# Altium schematic sheet Battery_Charger.SchDoc: Battery Charger and Power Management
size A4; Organization: TechLabs Global Pvt Ltd; DocumentNumber: 2; Revision: 1.0; SheetNumber: 2; SheetTotal: 3
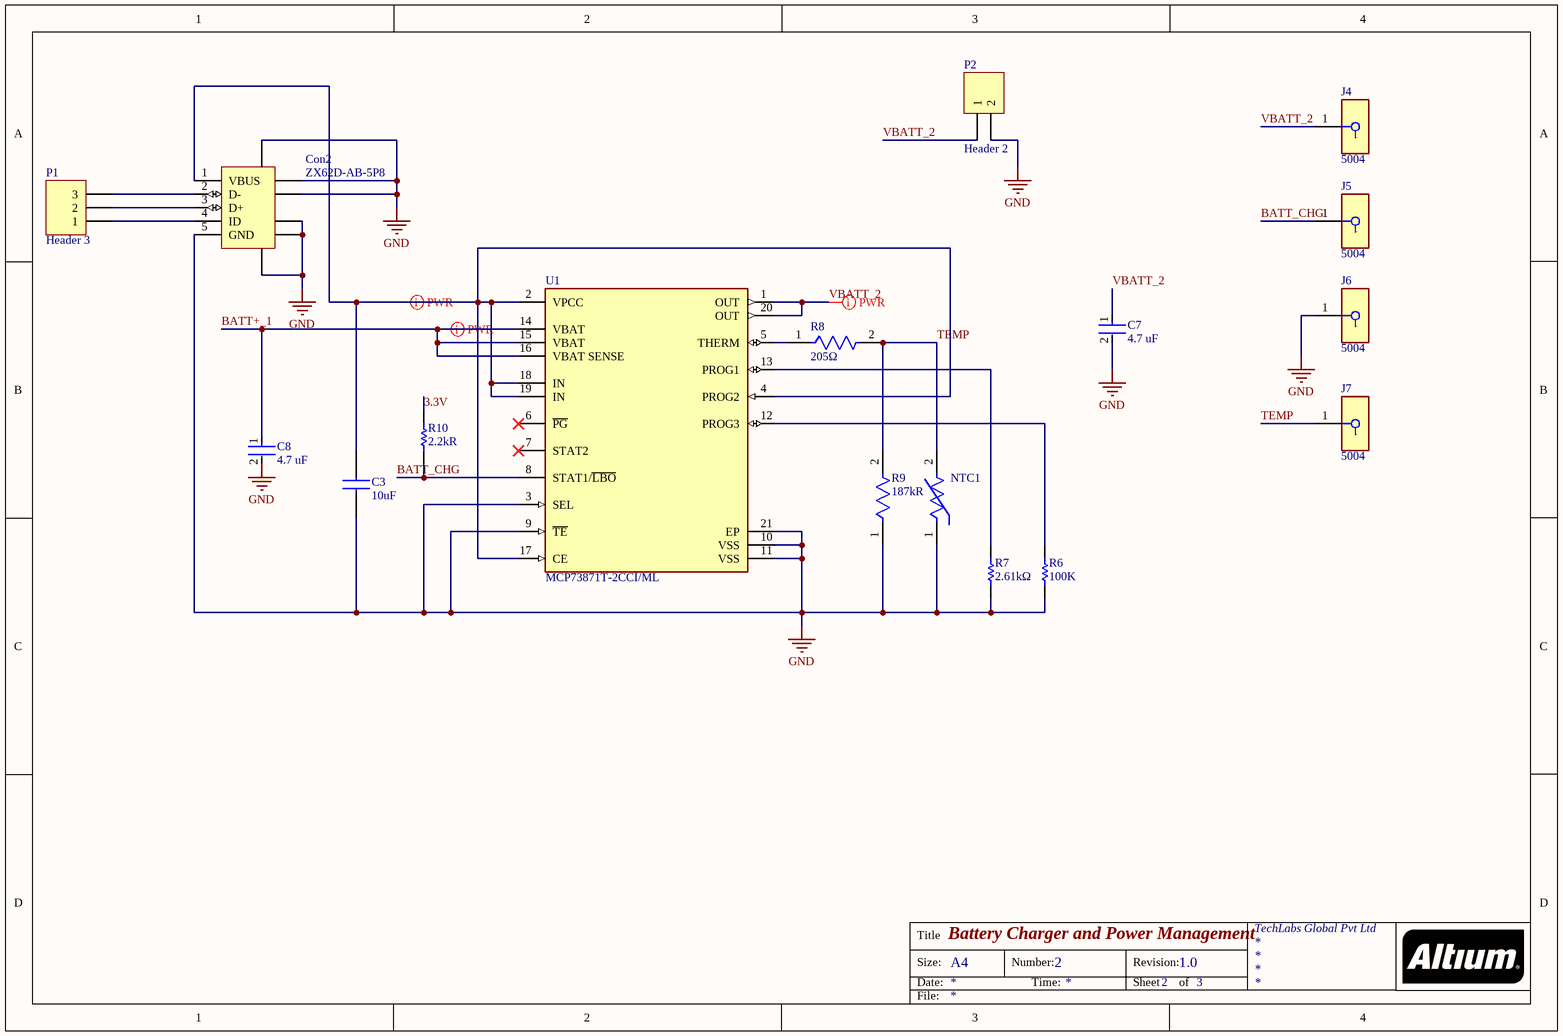
[diagram p0: Battery_Charger.SchDoc]

## Parts
C3  10uF  [CAPC1005X70N]
C7  4.7 uF  [FP-CC0402-MFG]
C8  4.7 uF  [FP-CC0402-MFG]
Con2  ZX62D-AB-5P8  [HIRO-ZX62D-AB-5P8_V]
J4  5004  [FP-5004-MFG]
J5  5004  [FP-5004-MFG]
J6  5004  [FP-5004-MFG]
J7  5004  [FP-5004-MFG]
NTC1  NTC 10K Radial Leaded  [FP-NXR_151B030-MFG]  (value not drawn)
P1  Header 3  [HDR1X3]
P2  Header 2  [HDR1X2]
R6  100K  [RESC1005X40X25NL05T10]
R7  2.61kΩ  [RESC1005X40X25NL05T10]
R8  205Ω  [FP-RT0402-MFG]
R9  187kR  [FP-AC0402-MFG]
R10  2.2kR  [RESC1005X40X25ML05T10]
U1  MCP73871T-2CCI/ML  [FP-C04-126-IPC_C]

## Nets
GND: C3.1 C7.2 C8.2 Con2.5(GND) Con2.6(SHLD) Con2.7(SHLD) Con2.8(SHLD) Con2.9(SHLD) Con2.10(SHLD) Con2.11(SHLD) J6.1 NTC1.1 P2.2 R6.1 R7.1 R9.1 U1.3(SEL) U1.9(~{TE}) U1.10(VSS) U1.11(VSS) U1.21(EP)
3.3V: R10.2
BATT+_1: C8.1 U1.14(VBAT) U1.15(VBAT) U1.16(VBAT_SENSE)
BATT_CHG: J5.1 R10.1 U1.8(STAT1/~{LBO})
TEMP: J7.1 NTC1.2 R8.2 R9.2
VBATT_2: C7.1 J4.1 P2.1 U1.1(OUT) U1.20(OUT)
NetC3_2: C3.2 Con2.1(VBUS) U1.2(VPCC) U1.4(PROG2) U1.17(CE) U1.18(IN) U1.19(IN)
NetCon2_2: Con2.2(D-) P1.3
NetCon2_3: Con2.3(D+) P1.2
NetCon2_4: Con2.4(ID) P1.1
NetR6_2: R6.2 U1.12(PROG3)
NetR7_2: R7.2 U1.13(PROG1)
NetR8_1: R8.1 U1.5(THERM)

Not connected (* = marked no-connect by the designer): U1 6(~{PG})* 7(STAT2)*

## Layout directives
rule Width Constraint [Pref Width = 20mil    Min Width = 12mil    Max Width = 36mil]: BATT+_1, NetC3_2, VBATT_2

## Notes on the sheet
- Title
- Size:
- Date:
- A4
- Number:
- Time:
- Revision:
- Sheet
- of
- File:

## Library data of the parts
C3 = CL05A106MQ5NUNC: CAP CER 10UF 6.3V X5R 0402; Manufacturer: Samsung Electro-Mechanics; Geometry.Height: 0.7mm; Mfr. Part #: CL05A106MQ5NUNC; Mouser Part Number: 187-CL05A106MQ5NUNC; Mouser Price/Stock: https://www.mouser.co.uk/ProductDetail/Samsung-Electro-Mechanics/CL05A106MQ5NUNC?qs=X6jEic%2FHinDK8vVLi1zwpw%3D%3D; Arrow Part Number: CL05A106MQ5NUNC; Arrow Price/Stock: https://www.arrow.com/en/products/cl05a106mq5nunc/samsung-electro-mechanics?region=nac; Datasheet Link: https://datasheet.datasheetarchive.com/originals/distributors/Datasheets-DGA10/2406160.pdf; LCSC Part #: C15525; Package: 0402; Value: 10uF; Digi-Key Part #: 1276-1451-2-ND
C7 C8 = CMP-1034-02137-2: CAP CER 4.7UF 6.3V X5R 0402; Manufacturer: YAGEO; Mfr. Part #: CC0402MRX5R5BB475; Temperature Coefficient: 30ppm/°C; Tolerance: 0.2; Automotive Grade: NA; Material: Ceramic; Automotive: No; Temperature: -55°C to +125°C; Category: Cap; Ipc Land Pattern Name: CAPC10050X50; Digikey Description: CAP CER 4.7UF 6.3V X5R 0402; ComponentLink2Description: Datasheet; Octopart: https://octopart.com/cc0402mrx5r5bb475-yageo-20021081; Mouser Description: Multilayer Ceramic Capacitors MLCC - SMD/SMT 4.7uF 6.3V X5R 20%; Device Class L1: Passive Components; Footprint Url: http://www.yageo.com/exep/pages/download/literatures/UPY-C_GEN_24.pdf; Value: 4.7 uF; Temperature Range High: +125°C; ComponentLink2URL: http://www.yageo.com/documents/recent/UPY-GP_NP0_16V-to-50V_16.pdf; Voltage Rating: 6.3 V; Height: 0.55mm; RoHS: TRUE; Package: CC0402; Device Class L3: Ceramic Capacitors; Temperature Characteristic: X5R; Temperature Range Low: -55°C; Capacitance: 4.7 uF; Device Class L2: Capacitors; Lead Free: Yes; LCSC Part #: C106859; Digi-Key Part #: 311-1730-2-ND
Con2 = CMP-1349-00001-2: USB 2.0 Standard Micro-USB Connector, Micro AB-Standard (Bottom Mount), 30 V AC, -30 to 85 degC, Right Angle, 5-Pin 7.5 x 5.6 x 2.8 mm SMD, RoHS, Reel; Mfr. Part #: ZX62D-AB-5P8(30); Manufacturer: Hirose Electric; Number of Contacts: 5; Capacitance: 2 pF Max.; Voltage Rating: 30 V AC; Contact Resistance: 30 mOhm Max.; Mounting Technology: Surface Mount; ComponentLink1URL: http://www.hirose.com/; ComponentLink2URL: http://www.hirose.co.jp/cataloge_hp/ed_ZX_20140804.pdf; ComponentLink1Description: Manufacturer URL; ComponentLink3Description: Package Specification; Operating Temperature Range: -30 to 85 degC; RoHS: TRUE; DatasheetVersion: Aug-14; PackageDescription: USB Micro-AB Connector, Right Angle, Body 7.5 x 5.6 mm, Pitch 0.65 mm, Height 2.8 mm; ComponentLink3URL: http://www.hirose.co.jp/cataloge_hp/ed_ZX_20140804.pdf; Packing: Reel; ComponentLink2Description: Datasheet; LCSC Part #: C598206; Package: SMD; Digi-Key Part #: H125271TR-ND
J4-J7 = CMP-2000-05575-2: PC TEST POINT MINIATURE YELLOW; Manufacturer: Keystone; Number Of Contacts: 1; Is Female: yes; Device Class L1: Connectors; Mfr. Part #: 5004; Digikey Description: PC TEST POINT MINIATURE YELLOW; ComponentLink2URL: https://www.keyelco.com/product-pdf.cfm?p=1313; Lead Free: Yes; ComponentLink2Description: Datasheet; Category: Conn; Height: 4.72mm; Octopart: https://octopart.com/5004-keystone-28591; Mouser Description: TEST POINT PC MINI .040"D YELLOW; Device Class L3: unset; Contact Material: Silver; Package: 5004; Automotive: No; Device Class L2: unset; RoHS: TRUE; LCSC Part #: C2906762; Digi-Key Part #: 36-5004-ND
NTC1 = CMP-06022-001050-1: NTC Thermistors ±1% 7.5mW 3380K ±1% 10kΩ Radial Leaded NTC Thermistors ROHS; Manufacturer: Murata Electronics; Mfr. Part #: NXRT15XH103FA1B030; Resistance: 10kR; Lead Diameter: 0.4mm; RoHS Compliant: Yes; Number of Pins: 2; Lead Free: Lead Free; Max Power Dissipation: 7.5mW; Height: 2mm; Lead Pitch: 2.5mm; Power Rating: 7.5mW; Series: NXR; Packaging: Bulk; Package Quantity: 500; Width: 4mm; Max Operating Temperature: 125°C; Termination: Radial; Min Operating Temperature: -40°C; Tolerance: 1%; Resistance Tolerance: 1%; Length: 5mm; Mount: Through Hole; B-Constant: 3380K; LCSC Part #: C152559; Datasheet: https://datasheet.lcsc.com/lcsc/1810170223_Murata-Electronics-NXRT15XH103FA1B030_C152559.pdf; Resistance in Ohms @ 25°C: 10K; Digi-Key Part #: 490-8601-ND
P1 = Header 3: Header, 3-Pin; LatestRevisionDate: 17-Jul-2002; LatestRevisionNote: Re-released for DXP Platform.; Publisher: Altium Limited
P2 = Header 2: Header, 2-Pin; LatestRevisionDate: 17-Jul-2002; LatestRevisionNote: Re-released for DXP Platform.; Publisher: Altium Limited
R6 = CMP-2002-07343-1: 100K ±1% 1/16W 0402 Chip Resistor - Surface Mount RoHS; Manufacturer: Yageo / Phycomp; Mfr. Part #: RC0402FR-07100KL; Resistance: 100K; LCSC Part #: Tolerance; Package: 0402; Power (Watts): 1/16W; Tolerance: ±1%; Digi-Key Part #: 311-100KLRTR-ND
R7 = CMP-2002-07573-1: 62.5mW Thick Film Resistors 50V ±100ppm/℃ ±1% -55℃~+155℃ 2.61kΩ 0402 Chip Resistor - Surface Mount ROHS; Manufacturer: Yageo / Phycomp; Mfr. Part #: RC0402FR-072K61L; LCSC Part #: C163472; Package: 0402; Value: 2.61kΩ; Tolerance: ±1%; Digi-Key Part #: YAG3103TR-ND
R8 = CMP-03412-026788-1: 205Ω 50V ±50ppm/℃ -55℃~+155℃ ±1% Thin Film Resistor 62.5mW 0402 Chip Resistor - Surface Mount ROHS; Mfr. Part #: RT0402FRE07205RL; Manufacturer: Yageo; Tolerance: 0.01; Power Rating: 0.063W; Temperature Coefficient: 50 ppm/°C; Temperature: -55°C to +155°C; Category: Res; ComponentLink2URL: http://www.yageo.com/documents/recent/PYu-RT_1-to-0.01_RoHS_L_9.pdf; Footprint Url: http://www.yageo.com/exep/pages/download/literatures/PYu-R_Mount_10.pdf; Octopart: https://octopart.com/rt0402fre07205rl-yageo-1208039; Device Class L3: Chip SMD Resistors; Device Class L1: Passive Components; Device Class L2: Resistors; Lead Free: Yes; Package: RT0402; Automotive: No; Series: RT; Composition: Thin Film; Value: 205Ω; Digikey Description: RES SMD 205 OHM 1% 1/16W 0402; Voltage Rating: 50V; Temperature Range High: +155°C; ComponentLink2Description: Datasheet; Ipc Land Pattern Name: RESC10050X30; Temperature Range Low: -55°C; RoHS: TRUE; Height: 0.35mm; Resistance: 205Ω; LCSC Part #: C327014; Digi-Key Part #: RT0402FRE07205RL-ND
R9 = CMP-03412-002180-2: 187kΩ ±1% -55℃~+155℃ 50V Thick Film Resistors 62.5mW ±100ppm/℃ 0402 Chip Resistor - Surface Mount ROHS; Manufacturer: YAGEO; Mfr. Part #: AC0402FR-07187KL; Max Power Dissipation: 63mW; Temperature Coefficient: 100ppm/°C; Series: AC; Tolerance: 1%; Resistor Type: Thick Film; Features: Moisture Resistant; Resistance: 187kR; RoHS Compliant: Yes; Length: 0.039inch; Width: 0.02inch; Height: 0.015inch; Number of Terminations: 2; Min Operating Temperature: -55°C; Package: 0402; Max Operating Temperature: 155°C; Packaging: Tape and Reel; Value: 187kR; LCSC Part #: C226824; Digi-Key Part #: 13-AC0402FR-07187KLTR-ND
R10 = CMP-2002-07567-1: 62.5mW Thick Film Resistors 50V ±100ppm/℃ ±1% -55℃~+155℃ 2.2kΩ 0402 Chip Resistor - Surface Mount ROHS; Manufacturer: Yageo / Phycomp; Mfr. Part #: RC0402FR-072K2L; Power (Watts): 63mW; LCSC Part #: C114762; Package: 0402; Tolerance: 1%; Value: 2.2kR; Digi-Key Part #: 311-2.20KLRTR-ND
U1 = CMP-06318-000014-1: IC USB/AC BATT CHRGR W/PPM 20QFN; Manufacturer: Microchip Technology; Mfr. Part # (Alternative): MCP73871-2CCI/ML; Min Supply Voltage: 4.5V; Output Current: 1A; Output Voltage: 4.2V; Max Supply Voltage: 6V; Case/Package: QFN; RoHS Compliant: Yes; Min Operating Temperature: -40°C; Mount: Surface Mount; Package Quantity: 3300; Packaging: Tape and Reel; Number of Pins: 20; Max Operating Temperature: 85°C; Lead Free: Lead Free; Contact Plating: Tin; Mfr. Part #: MCP73871T-2CCI/ML; Package: QFN-20(4x4); Digi-Key Part #: MCP73871T-2CCI/MLTR-ND